# Altium schematic sheet Input Connectors and Sensors.SchDoc
size A4; SheetNumber: 2; SheetTotal: 8; SPICEModelCacheJCJFNBCI: <root> / <DocumentId>JCJFNBCI</DocumentId> / <CacheFrame Number="0"> / <Model Name="res" Kind="MDL"> / <Text>*Default semiconductor resistor / .MODEL RES R()</Text> / </Model> / <Model Name="cap" Kind="MDL"> / <Text>*Default semiconductor capacitor / .MODEL CAP C()</Text> / </Model> / </CacheFrame> / </root>
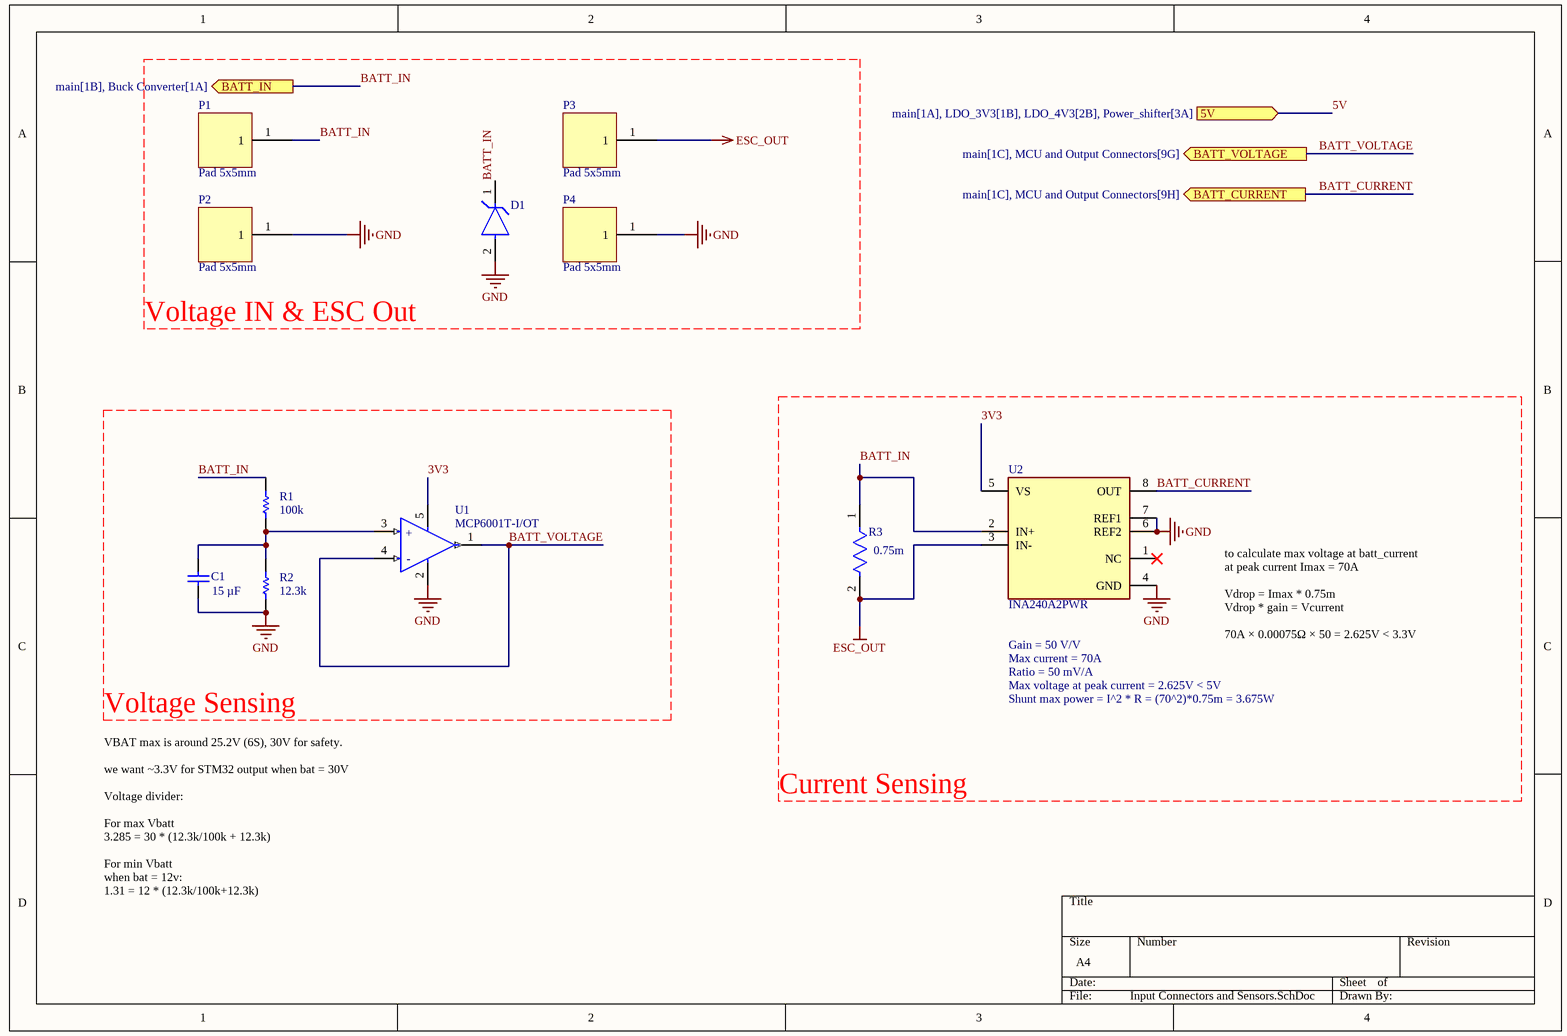
[diagram p0: Input Connectors and Sensors.SchDoc]

## Parts
C1  value 15 µF  [0603_CAPC1608L]  (hidden comment: Cap Semi)
D1  1.5SMC30AHE3_A/H  [FP-SMC-MFG]  (value not drawn)
P1  Pad 5x5mm  [PAD 5X5MM]
P2  Pad 5x5mm  [PAD 5X5MM]
P3  Pad 5x5mm  [PAD 5X5MM]
P4  Pad 5x5mm  [PAD 5X5MM]
R1  value 100k  [0402_RESC1005L]  (hidden comment: Res Semi)
R2  value 12.3k  [0402_RESC1005L]  (hidden comment: Res Semi)
R3  Resistance: 0.75m  [FP-AC2512-MFG]  (hidden comment: SCMM2512S5-R001F)
U1  MCP6001T-I/OT  [FP-C04-091-OT-IPC_A]
U2  INA240A2PWR  [FP-PW0008A-MFG]

## Ports
5V (in, see main[1A], LDO_3V3[1B], LDO_4V3[2B], Power_shifter[3A]), BATT_CURRENT (out, see main[1C], MCU and Output Connectors[9H]), BATT_IN (out, see main[1B], Buck Converter[1A]), BATT_VOLTAGE (out, see main[1C], MCU and Output Connectors[9G])

## Nets
ESC_OUT: P3.1 R3.2 U2.3(IN-)
GND: C1.1 D1.2(A) P2.1 P4.1 R2.1 U1.2(VSS) U2.4(GND) U2.6(REF2) U2.7(REF1)
3V3: U1.5(VDD) U2.5(VS)
5V: port 5V
BATT_CURRENT: U2.8(OUT) ; port BATT_CURRENT
BATT_IN: D1.1(C) P1.1 R1.2 R3.1 U2.2(IN+) ; port BATT_IN
BATT_VOLTAGE: U1.1(VOUT) U1.4(VIN-) ; port BATT_VOLTAGE
NetC1_2: C1.2 R1.1 R2.2 U1.3(VIN+)

Not connected (* = marked no-connect by the designer): U2 1(NC)*

## Notes on the sheet
- Voltage IN & ESC Out
- Gain = 50 V/V
- Voltage Sensing
- Max current = 70A
- Ratio = 50 mV/A
- Max voltage at peak current = 2.625V < 5V
- Shunt max power = I^2 * R = (70^2)*0.75m = 3.675W
- to calculate max voltage at batt_current at peak current Imax = 70A
  Vdrop = Imax * 0.75m
  Vdrop * gain = Vcurrent
  70A × 0.00075Ω × 50 = 2.625V < 3.3V
- Current Sensing
- VBAT max is around 25.2V (6S), 30V for safety.
  we want ~3.3V for STM32 output when bat = 30V
  Voltage divider:
  For max Vbatt
  3.285 = 30 * (12.3k/100k + 12.3k)
  For min Vbatt
  when bat = 12v:
  1.31 = 12 * (12.3k/100k+12.3k)
- (in symbol CMP-0187-00462-3) +; -

## Library data of the parts
C1 = Cap Semi: Capacitor (Semiconductor SIM Model); Published: 8-Jun-2000; LatestRevisionDate: 29-May-2009; LatestRevisionNote: IPC-7351 Footprint Added.; PackageReference: C1206; Publisher: Altium Limited; PackageDescription: Chip Capacitor; Digikey part#: *; Manufacturer: *; Manufacturer part#: *
D1 = CMP-02577-000023-1: TVS DIODE 25.6VWM 41.4VC SMC
R1 R2 = Res Semi: Semiconductor Resistor; Published: 8-Jun-2000; LatestRevisionDate: 17-Jul-2002; LatestRevisionNote: Re-released for DXP Platform.; PackageReference: AXIAL-0.5; Publisher: Altium Limited; Digikey part#: *; Manufacturer: *; Manufacturer part#: *
R3 = CMP-03412-007688-1: RES 0.001 OHM 1% 5W 2512; Manufacturer Part Number: AC2512JK-072K4L; Manufacturer: Yageo; Power Rating: 1W; Tolerance: 0.05; Voltage Rating: 200V; Value: 1mΩ; Automotive Grade: Grade 0; ComponentLink2Description: Datasheet; Height: 0.65mm; Octopart: https://octopart.com/ac2512jk-072k4l-yageo-71370358; Automotive: Yes; Device Class L3: Chip SMD Resistors; Device Class L1: Passive Components; Category: Res; Temperature Range Low: -55°C; Digikey Description: RES SMD 2.4K OHM 5% 1W 2512; Temperature: -55°C to +155°C; Package: AC2512; Lead Free: Yes; Footprint Url: http://www.yageo.com/exep/pages/download/literatures/PYu-R_Mount_10.pdf; Series: AC; Device Class L2: Resistors; Composition: Thick Film; ComponentLink2URL: http://www.yageo.com/documents/recent/PYu-AC_51_RoHS_L_6.pdf; Temperature Range High: +155°C; RoHS: TRUE; Ipc Land Pattern Name: RESC635310X55
U1 = CMP-0187-00462-3: IC OPAMP GP 1 CIRCUIT SOT23-5; Number of Amplifiers: 1; Voltage: 6V; Power Supply Rejection Ratio (PSRR): 86dB; Common Mode Rejection Ratio: 60dB; Unity Gain Bandwidth Product: 1MHz; Slew Rate: 0.6V/µs; Output Current per Channel: 23mA; Nominal Supply Current: 100uA; Input Offset Voltage (Vos): 4.5mV; Input Bias Current: 1pA; Operating Supply Voltage: 5.5V; Min Supply Voltage: 1.8V; Voltage Gain: 112dB; Length: 3.1mm; REACH SVHC: No SVHC; Number of Pins: 5; Package Quantity: 1; Radiation Hardening: No; Mount: Surface Mount; Number of Circuits: 1; Number of Elements: 1; Output Current: 23mA; Packaging: Tape and Reel; Height: 1.3mm; Lead Free: Lead Free; Min Operating Temperature: -40°C; Bandwidth: 1MHz; Contact Plating: Tin; Max Supply Voltage: 6V; Max Operating Temperature: 85°C; Width: 1.8mm; Case/Package: SOT-23; Operating Supply Current: 100uA; Number of Channels: 1; Gain Bandwidth Product: 1MHz
U2 = CMP-04895-000047-1: IC AMP CURRENT SENSE 8-TSSOP; Manufacturer: Texas Instruments; Voltage Gain: 0.05V/mV; Max Supply Voltage: 5.5V; Max Junction Temp: +150°C; Input Offset Voltage: 0.005mV; Bandwidth: 400kHz; Min Supply Voltage: 2.7V; Nominal Supply Current: 1.8mA; Standoff Height: 0.05mm; Number Of Channels: 1; Input Bias Current: 90uA; ComponentLink2URL: http://www.ti.com/lit/ds/symlink/ina240.pdf; Device Class L2: Linear ICs; ComponentLink2Description: Datasheet; Temperature: -40°C to +125°C; Octopart: https://octopart.com/ina240a2pwr-texas+instruments-75431049; Automotive: No; Manufacturer Part Number: INA240A2PWR; Ambient Temperature Range Low: -40°C; RoHS: TRUE; Package: PW0008A; Device Class L1: Integrated Circuits (ICs); Temperature Range Low: -40°C; Category: IC; Ipc Land Pattern Name: SOP65P300X120-8; Temperature Range High: +125°C; Ambient Temperature Range High: +125°C; Height: 1.2mm; Lead Free: Yes; Device Class L3: Instrumentation; Digikey Description: IC AMP CURRENT SENSE 8-TSSOP